# EAGLE schematic axiom_beta_interface_dummy_v0.13.8a810f79 (EAGLE 7.0.0)

## Sheet 1 of 2
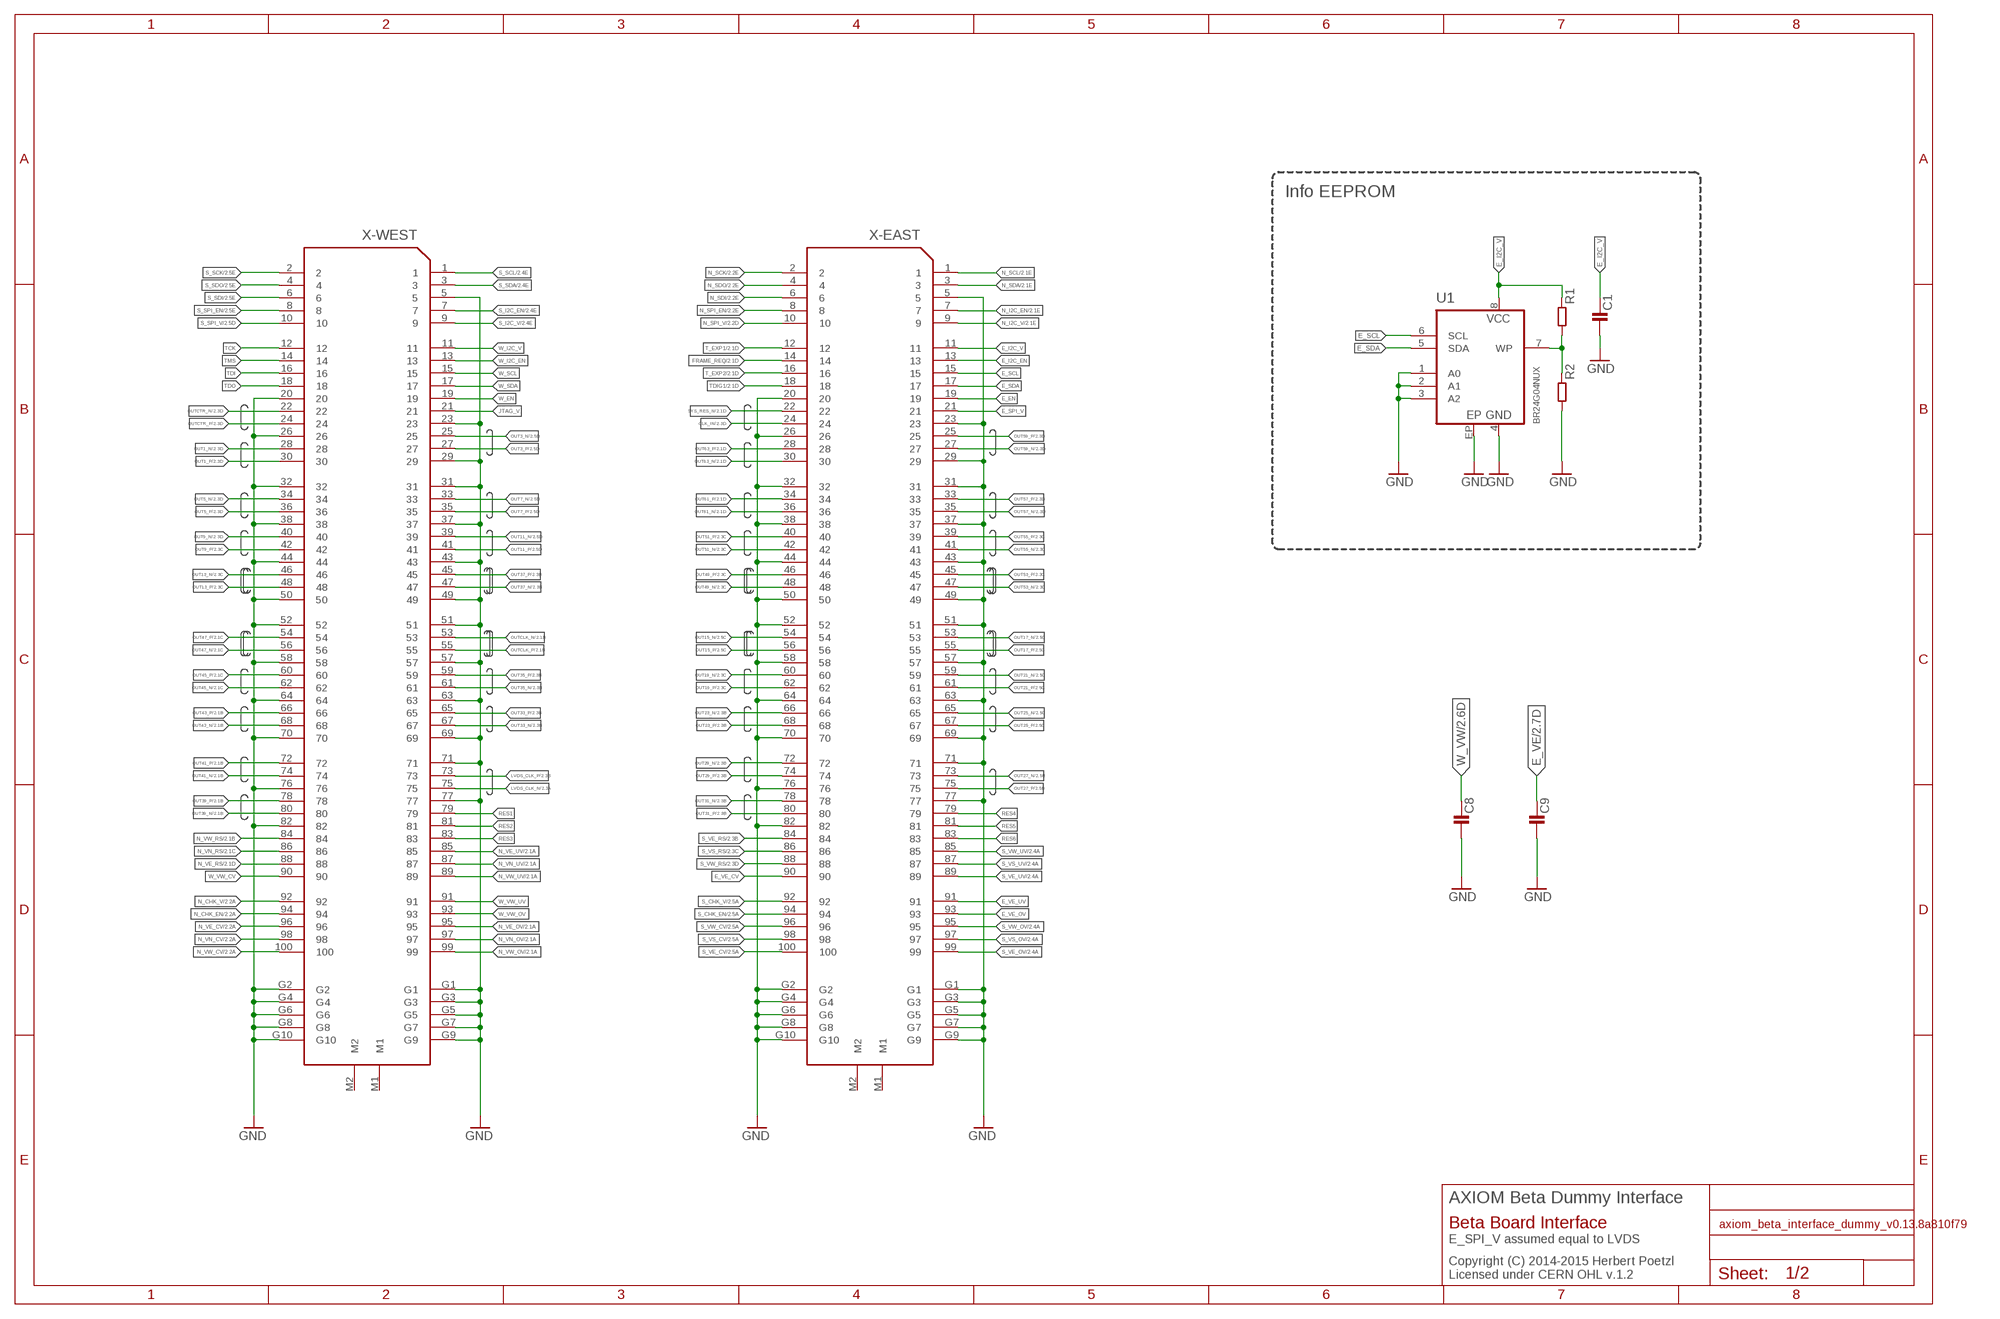
[diagram p0: schematic, sheet 1]

### Parts
C1  C0402-B  [0402-B]
C8  C0805-B  [0805-B]
C9  C0805-B  [0805-B]
R1  R0402-B  [0402-B]
R2  R0402-B  [0402-B]
U1  BR24G04NUX  [DFN200X300X100-9N]
X-EAST  FX10-100/10P  [FX10A-100P/10]
X-WEST  FX10-100/10P  [FX10A-100P/10]

### Nets
CLK_IN: X-EAST.24 ; also sheet 2
E_EN: X-EAST.19
E_I2C_EN: X-EAST.13
E_I2C_V: C1.1 R1.1 U1.8(VCC) X-EAST.11
E_SCL: U1.6(SCL) X-EAST.15
E_SDA: U1.5(SDA) X-EAST.17
E_SPI_V: X-EAST.21
E_VE: C9.1 ; also sheet 2
E_VE_CV: X-EAST.90
E_VE_OV: X-EAST.93
E_VE_UV: X-EAST.91
FRAME_REQ: X-EAST.14 ; also sheet 2
GND [power]: C1.2 C8.2 C9.2 R2.2 U1.1(A0) U1.2(A1) U1.3(A2) U1.4(GND) U1.EP X-EAST.5 X-EAST.20 X-EAST.23 X-EAST.26 X-EAST.29 X-EAST.31 X-EAST.32 X-EAST.37 X-EAST.38 X-EAST.43 X-EAST.44 X-EAST.49 X-EAST.50 X-EAST.51 X-EAST.52 X-EAST.57 X-EAST.58 X-EAST.63 X-EAST.64 X-EAST.69 X-EAST.70 X-EAST.71 X-EAST.76 X-EAST.77 X-EAST.82 X-EAST.G1 X-EAST.G2 X-EAST.G3 X-EAST.G4 X-EAST.G5 X-EAST.G6 X-EAST.G7 X-EAST.G8 X-EAST.G9 X-EAST.G10 X-WEST.5 X-WEST.20 X-WEST.23 X-WEST.26 X-WEST.29 X-WEST.31 X-WEST.32 X-WEST.37 X-WEST.38 X-WEST.43 X-WEST.44 X-WEST.49 X-WEST.50 X-WEST.51 X-WEST.52 X-WEST.57 X-WEST.58 X-WEST.63 X-WEST.64 X-WEST.69 X-WEST.70 X-WEST.71 X-WEST.76 X-WEST.77 X-WEST.82 X-WEST.G1 X-WEST.G2 X-WEST.G3 X-WEST.G4 X-WEST.G5 X-WEST.G6 X-WEST.G7 X-WEST.G8 X-WEST.G9 X-WEST.G10 ; also sheet 2
JTAG_V: X-WEST.21
LVDS_CLK_N: X-WEST.75 ; also sheet 2
LVDS_CLK_P: X-WEST.73 ; also sheet 2
N$12: R1.2 R2.1 U1.7(WP)
N_CHK_EN: X-WEST.94 ; also sheet 2
N_CHK_V: X-WEST.92 ; also sheet 2
N_I2C_EN: X-EAST.7 ; also sheet 2
N_I2C_V: X-EAST.9 ; also sheet 2
N_SCK: X-EAST.2 ; also sheet 2
N_SCL: X-EAST.1 ; also sheet 2
N_SDA: X-EAST.3 ; also sheet 2
N_SDI: X-EAST.6 ; also sheet 2
N_SDO: X-EAST.4 ; also sheet 2
N_SPI_EN: X-EAST.8 ; also sheet 2
N_SPI_V: X-EAST.10 ; also sheet 2
N_VE_CV: X-WEST.96 ; also sheet 2
N_VE_OV: X-WEST.95 ; also sheet 2
N_VE_RS: X-WEST.88 ; also sheet 2
N_VE_UV: X-WEST.85 ; also sheet 2
N_VN_CV: X-WEST.98 ; also sheet 2
N_VN_OV: X-WEST.97 ; also sheet 2
N_VN_RS: X-WEST.86 ; also sheet 2
N_VN_UV: X-WEST.87 ; also sheet 2
N_VW_CV: X-WEST.100 ; also sheet 2
N_VW_OV: X-WEST.99 ; also sheet 2
N_VW_RS: X-WEST.84 ; also sheet 2
N_VW_UV: X-WEST.89 ; also sheet 2
OUT1_N: X-WEST.28 ; also sheet 2
OUT1_P: X-WEST.30 ; also sheet 2
OUT3_N: X-WEST.25 ; also sheet 2
OUT3_P: X-WEST.27 ; also sheet 2
OUT5_N: X-WEST.34 ; also sheet 2
OUT5_P: X-WEST.36 ; also sheet 2
OUT7_N: X-WEST.33 ; also sheet 2
OUT7_P: X-WEST.35 ; also sheet 2
OUT9_N: X-WEST.40 ; also sheet 2
OUT9_P: X-WEST.42 ; also sheet 2
OUT11_N: X-WEST.39 ; also sheet 2
OUT11_P: X-WEST.41 ; also sheet 2
OUT13_N: X-WEST.46 ; also sheet 2
OUT13_P: X-WEST.48 ; also sheet 2
OUT15_N: X-EAST.54 ; also sheet 2
OUT15_P: X-EAST.56 ; also sheet 2
OUT17_N: X-EAST.53 ; also sheet 2
OUT17_P: X-EAST.55 ; also sheet 2
OUT19_N: X-EAST.60 ; also sheet 2
OUT19_P: X-EAST.62 ; also sheet 2
OUT21_N: X-EAST.59 ; also sheet 2
OUT21_P: X-EAST.61 ; also sheet 2
OUT23_N: X-EAST.66 ; also sheet 2
OUT23_P: X-EAST.68 ; also sheet 2
OUT25_N: X-EAST.65 ; also sheet 2
OUT25_P: X-EAST.67 ; also sheet 2
OUT27_N: X-EAST.73 ; also sheet 2
OUT27_P: X-EAST.75 ; also sheet 2
OUT29_N: X-EAST.72 ; also sheet 2
OUT29_P: X-EAST.74 ; also sheet 2
OUT31_N: X-EAST.78 ; also sheet 2
OUT31_P: X-EAST.80 ; also sheet 2
OUT33_N: X-WEST.67 ; also sheet 2
OUT33_P: X-WEST.65 ; also sheet 2
OUT35_N: X-WEST.61 ; also sheet 2
OUT35_P: X-WEST.59 ; also sheet 2
OUT37_N: X-WEST.47 ; also sheet 2
OUT37_P: X-WEST.45 ; also sheet 2
OUT39_N: X-WEST.80 ; also sheet 2
OUT39_P: X-WEST.78 ; also sheet 2
OUT41_N: X-WEST.74 ; also sheet 2
OUT41_P: X-WEST.72 ; also sheet 2
OUT43_N: X-WEST.68 ; also sheet 2
OUT43_P: X-WEST.66 ; also sheet 2
OUT45_N: X-WEST.62 ; also sheet 2
OUT45_P: X-WEST.60 ; also sheet 2
OUT47_N: X-WEST.56 ; also sheet 2
OUT47_P: X-WEST.54 ; also sheet 2
OUT49_N: X-EAST.48 ; also sheet 2
OUT49_P: X-EAST.46 ; also sheet 2
OUT51_N: X-EAST.42 ; also sheet 2
OUT51_P: X-EAST.40 ; also sheet 2
OUT53_N: X-EAST.47 ; also sheet 2
OUT53_P: X-EAST.45 ; also sheet 2
OUT55_N: X-EAST.41 ; also sheet 2
OUT55_P: X-EAST.39 ; also sheet 2
OUT57_N: X-EAST.35 ; also sheet 2
OUT57_P: X-EAST.33 ; also sheet 2
OUT59_N: X-EAST.27 ; also sheet 2
OUT59_P: X-EAST.25 ; also sheet 2
OUT61_N: X-EAST.36 ; also sheet 2
OUT61_P: X-EAST.34 ; also sheet 2
OUT63_N: X-EAST.30 ; also sheet 2
OUT63_P: X-EAST.28 ; also sheet 2
OUTCLK_N: X-WEST.53 ; also sheet 2
OUTCLK_P: X-WEST.55 ; also sheet 2
OUTCTR_N: X-WEST.22 ; also sheet 2
OUTCTR_P: X-WEST.24 ; also sheet 2
RES1: X-WEST.79
RES2: X-WEST.81
RES3: X-WEST.83
RES4: X-EAST.79
RES5: X-EAST.81
RES6: X-EAST.83
S_CHK_EN: X-EAST.94 ; also sheet 2
S_CHK_V: X-EAST.92 ; also sheet 2
S_I2C_EN: X-WEST.7 ; also sheet 2
S_I2C_V: X-WEST.9 ; also sheet 2
S_SCK: X-WEST.2 ; also sheet 2
S_SCL: X-WEST.1 ; also sheet 2
S_SDA: X-WEST.3 ; also sheet 2
S_SDI: X-WEST.6 ; also sheet 2
S_SDO: X-WEST.4 ; also sheet 2
S_SPI_EN: X-WEST.8 ; also sheet 2
S_SPI_V: X-WEST.10 ; also sheet 2
S_VE_CV: X-EAST.100 ; also sheet 2
S_VE_OV: X-EAST.99 ; also sheet 2
S_VE_RS: X-EAST.84 ; also sheet 2
S_VE_UV: X-EAST.89 ; also sheet 2
S_VS_CV: X-EAST.98 ; also sheet 2
S_VS_OV: X-EAST.97 ; also sheet 2
S_VS_RS: X-EAST.86 ; also sheet 2
S_VS_UV: X-EAST.87 ; also sheet 2
S_VW_CV: X-EAST.96 ; also sheet 2
S_VW_OV: X-EAST.95 ; also sheet 2
S_VW_RS: X-EAST.88 ; also sheet 2
S_VW_UV: X-EAST.85 ; also sheet 2
SYS_RES_N: X-EAST.22 ; also sheet 2
T_EXP1: X-EAST.12 ; also sheet 2
T_EXP2: X-EAST.16 ; also sheet 2
TCK: X-WEST.12
TDI: X-WEST.16
TDIG1: X-EAST.18 ; also sheet 2
TDO: X-WEST.18
TMS: X-WEST.14
W_EN: X-WEST.19
W_I2C_EN: X-WEST.13
W_I2C_V: X-WEST.11
W_SCL: X-WEST.15
W_SDA: X-WEST.17
W_VW: C8.1 ; also sheet 2
W_VW_CV: X-WEST.90
W_VW_OV: X-WEST.93
W_VW_UV: X-WEST.91
Unconnected: X-EAST.M1 X-EAST.M2 X-WEST.M1 X-WEST.M2

### Notes on the sheet
- Info EEPROM
- AXIOM Beta Dummy Interface
- Beta Board Interface
- E_SPI_V assumed equal to LVDS
- Copyright (C) 2014-2015 Herbert Poetzl
  Licensed under CERN OHL v.1.2

## Sheet 2 of 2
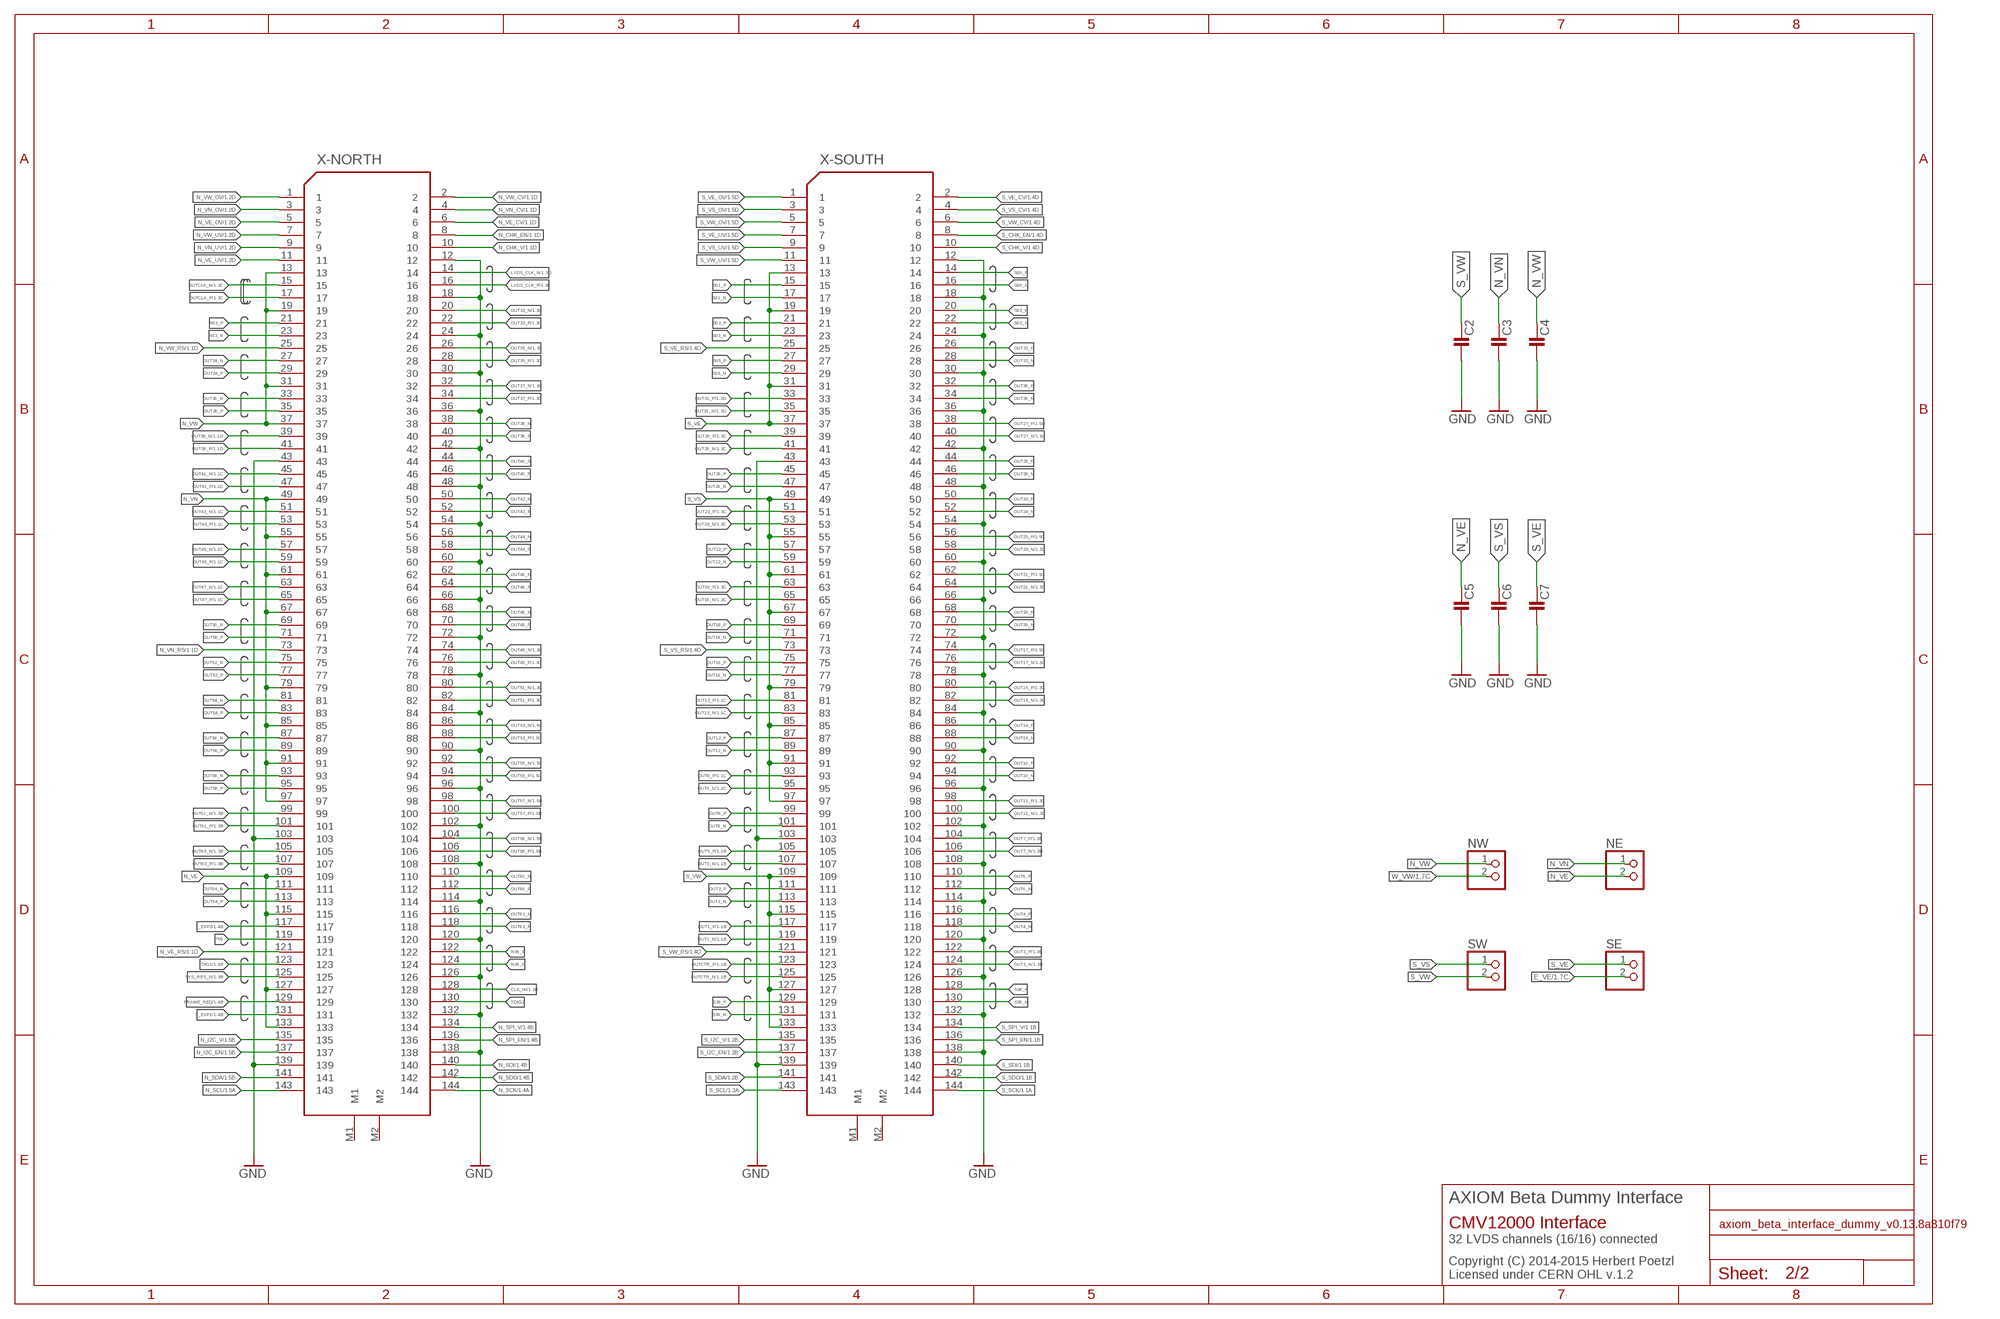
[diagram p1: schematic, sheet 2]

### Parts
C2  C0805-B  [0805-B]
C3  C0805-B  [0805-B]
C4  C0805-B  [0805-B]
C5  C0805-B  [0805-B]
C6  C0805-B  [0805-B]
C7  C0805-B  [0805-B]
NE  PINHD-1X02_2.54  [1X02]
NW  PINHD-1X02_2.54  [1X02]
SE  PINHD-1X02_2.54  [1X02]
SW  PINHD-1X02_2.54  [1X02]
X-NORTH  FX10-144S  [FX10A-144S]
X-SOUTH  FX10-144S  [FX10A-144S]

### Nets
CLK_IN: X-NORTH.128 ; also sheet 1
E_VE: SE.2 ; also sheet 1
FRAME_REQ: X-NORTH.129 ; also sheet 1
GND [power]: C2.2 C3.2 C4.2 C5.2 C6.2 C7.2 X-NORTH.12 X-NORTH.18 X-NORTH.24 X-NORTH.30 X-NORTH.36 X-NORTH.42 X-NORTH.43 X-NORTH.48 X-NORTH.54 X-NORTH.60 X-NORTH.66 X-NORTH.72 X-NORTH.78 X-NORTH.84 X-NORTH.90 X-NORTH.96 X-NORTH.102 X-NORTH.103 X-NORTH.108 X-NORTH.114 X-NORTH.120 X-NORTH.126 X-NORTH.132 X-NORTH.138 X-NORTH.139 X-SOUTH.12 X-SOUTH.18 X-SOUTH.24 X-SOUTH.30 X-SOUTH.36 X-SOUTH.42 X-SOUTH.43 X-SOUTH.48 X-SOUTH.54 X-SOUTH.60 X-SOUTH.66 X-SOUTH.72 X-SOUTH.78 X-SOUTH.84 X-SOUTH.90 X-SOUTH.96 X-SOUTH.102 X-SOUTH.103 X-SOUTH.108 X-SOUTH.114 X-SOUTH.120 X-SOUTH.126 X-SOUTH.132 X-SOUTH.138 X-SOUTH.139 ; also sheet 1
LVDS_CLK_N: X-NORTH.14 ; also sheet 1
LVDS_CLK_P: X-NORTH.16 ; also sheet 1
N03_N: X-NORTH.23
N03_P: X-NORTH.21
N36_N: X-NORTH.124
N36_P: X-NORTH.122
N_CHK_EN: X-NORTH.8 ; also sheet 1
N_CHK_V: X-NORTH.10 ; also sheet 1
N_I2C_EN: X-NORTH.137 ; also sheet 1
N_I2C_V: X-NORTH.135 ; also sheet 1
N_SCK: X-NORTH.144 ; also sheet 1
N_SCL: X-NORTH.143 ; also sheet 1
N_SDA: X-NORTH.141 ; also sheet 1
N_SDI: X-NORTH.140 ; also sheet 1
N_SDO: X-NORTH.142 ; also sheet 1
N_SPI_EN: X-NORTH.136 ; also sheet 1
N_SPI_V: X-NORTH.134 ; also sheet 1
N_VE [power]: C5.1 NE.2 X-NORTH.109 X-NORTH.115 X-NORTH.127 X-NORTH.133
N_VE_CV: X-NORTH.6 ; also sheet 1
N_VE_OV: X-NORTH.5 ; also sheet 1
N_VE_RS: X-NORTH.121 ; also sheet 1
N_VE_UV: X-NORTH.11 ; also sheet 1
N_VN [power]: C3.1 NE.1 X-NORTH.49 X-NORTH.55 X-NORTH.61 X-NORTH.67 X-NORTH.79 X-NORTH.85 X-NORTH.91 X-NORTH.97
N_VN_CV: X-NORTH.4 ; also sheet 1
N_VN_OV: X-NORTH.3 ; also sheet 1
N_VN_RS: X-NORTH.73 ; also sheet 1
N_VN_UV: X-NORTH.9 ; also sheet 1
N_VW [power]: C4.1 NW.1 X-NORTH.13 X-NORTH.19 X-NORTH.31 X-NORTH.37
N_VW_CV: X-NORTH.2 ; also sheet 1
N_VW_OV: X-NORTH.1 ; also sheet 1
N_VW_RS: X-NORTH.25 ; also sheet 1
N_VW_UV: X-NORTH.7 ; also sheet 1
OUT1_N: X-SOUTH.119 ; also sheet 1
OUT1_P: X-SOUTH.117 ; also sheet 1
OUT2_N: X-SOUTH.113
OUT2_P: X-SOUTH.111
OUT3_N: X-SOUTH.124 ; also sheet 1
OUT3_P: X-SOUTH.122 ; also sheet 1
OUT4_N: X-SOUTH.118
OUT4_P: X-SOUTH.116
OUT5_N: X-SOUTH.107 ; also sheet 1
OUT5_P: X-SOUTH.105 ; also sheet 1
OUT6_N: X-SOUTH.112
OUT6_P: X-SOUTH.110
OUT7_N: X-SOUTH.106 ; also sheet 1
OUT7_P: X-SOUTH.104 ; also sheet 1
OUT8_N: X-SOUTH.101
OUT8_P: X-SOUTH.99
OUT9_N: X-SOUTH.95 ; also sheet 1
OUT9_P: X-SOUTH.93 ; also sheet 1
OUT10_N: X-SOUTH.94
OUT10_P: X-SOUTH.92
OUT11_N: X-SOUTH.100 ; also sheet 1
OUT11_P: X-SOUTH.98 ; also sheet 1
OUT12_N: X-SOUTH.89
OUT12_P: X-SOUTH.87
OUT13_N: X-SOUTH.83 ; also sheet 1
OUT13_P: X-SOUTH.81 ; also sheet 1
OUT14_N: X-SOUTH.88
OUT14_P: X-SOUTH.86
OUT15_N: X-SOUTH.82 ; also sheet 1
OUT15_P: X-SOUTH.80 ; also sheet 1
OUT16_N: X-SOUTH.77
OUT16_P: X-SOUTH.75
OUT17_N: X-SOUTH.76 ; also sheet 1
OUT17_P: X-SOUTH.74 ; also sheet 1
OUT18_N: X-SOUTH.71
OUT18_P: X-SOUTH.69
OUT19_N: X-SOUTH.65 ; also sheet 1
OUT19_P: X-SOUTH.63 ; also sheet 1
OUT20_N: X-SOUTH.70
OUT20_P: X-SOUTH.68
OUT21_N: X-SOUTH.64 ; also sheet 1
OUT21_P: X-SOUTH.62 ; also sheet 1
OUT22_N: X-SOUTH.59
OUT22_P: X-SOUTH.57
OUT23_N: X-SOUTH.53 ; also sheet 1
OUT23_P: X-SOUTH.51 ; also sheet 1
OUT24_N: X-SOUTH.52
OUT24_P: X-SOUTH.50
OUT25_N: X-SOUTH.58 ; also sheet 1
OUT25_P: X-SOUTH.56 ; also sheet 1
OUT26_N: X-SOUTH.47
OUT26_P: X-SOUTH.45
OUT27_N: X-SOUTH.40 ; also sheet 1
OUT27_P: X-SOUTH.38 ; also sheet 1
OUT28_N: X-SOUTH.46
OUT28_P: X-SOUTH.44
OUT29_N: X-SOUTH.41 ; also sheet 1
OUT29_P: X-SOUTH.39 ; also sheet 1
OUT30_N: X-SOUTH.34
OUT30_P: X-SOUTH.32
OUT31_N: X-SOUTH.35 ; also sheet 1
OUT31_P: X-SOUTH.33 ; also sheet 1
OUT32_N: X-SOUTH.28
OUT32_P: X-SOUTH.26
OUT33_N: X-NORTH.20 ; also sheet 1
OUT33_P: X-NORTH.22 ; also sheet 1
OUT34_N: X-NORTH.27
OUT34_P: X-NORTH.29
OUT35_N: X-NORTH.26 ; also sheet 1
OUT35_P: X-NORTH.28 ; also sheet 1
OUT36_N: X-NORTH.33
OUT36_P: X-NORTH.35
OUT37_N: X-NORTH.32 ; also sheet 1
OUT37_P: X-NORTH.34 ; also sheet 1
OUT38_N: X-NORTH.38
OUT38_P: X-NORTH.40
OUT39_N: X-NORTH.39 ; also sheet 1
OUT39_P: X-NORTH.41 ; also sheet 1
OUT40_N: X-NORTH.44
OUT40_P: X-NORTH.46
OUT41_N: X-NORTH.45 ; also sheet 1
OUT41_P: X-NORTH.47 ; also sheet 1
OUT42_N: X-NORTH.50
OUT42_P: X-NORTH.52
OUT43_N: X-NORTH.51 ; also sheet 1
OUT43_P: X-NORTH.53 ; also sheet 1
OUT44_N: X-NORTH.56
OUT44_P: X-NORTH.58
OUT45_N: X-NORTH.57 ; also sheet 1
OUT45_P: X-NORTH.59 ; also sheet 1
OUT46_N: X-NORTH.62
OUT46_P: X-NORTH.64
OUT47_N: X-NORTH.63 ; also sheet 1
OUT47_P: X-NORTH.65 ; also sheet 1
OUT48_N: X-NORTH.68
OUT48_P: X-NORTH.70
OUT49_N: X-NORTH.74 ; also sheet 1
OUT49_P: X-NORTH.76 ; also sheet 1
OUT50_N: X-NORTH.69
OUT50_P: X-NORTH.71
OUT51_N: X-NORTH.80 ; also sheet 1
OUT51_P: X-NORTH.82 ; also sheet 1
OUT52_N: X-NORTH.75
OUT52_P: X-NORTH.77
OUT53_N: X-NORTH.86 ; also sheet 1
OUT53_P: X-NORTH.88 ; also sheet 1
OUT54_N: X-NORTH.81
OUT54_P: X-NORTH.83
OUT55_N: X-NORTH.92 ; also sheet 1
OUT55_P: X-NORTH.94 ; also sheet 1
OUT56_N: X-NORTH.87
OUT56_P: X-NORTH.89
OUT57_N: X-NORTH.98 ; also sheet 1
OUT57_P: X-NORTH.100 ; also sheet 1
OUT58_N: X-NORTH.93
OUT58_P: X-NORTH.95
OUT59_N: X-NORTH.104 ; also sheet 1
OUT59_P: X-NORTH.106 ; also sheet 1
OUT60_N: X-NORTH.110
OUT60_P: X-NORTH.112
OUT61_N: X-NORTH.99 ; also sheet 1
OUT61_P: X-NORTH.101 ; also sheet 1
OUT62_N: X-NORTH.116
OUT62_P: X-NORTH.118
OUT63_N: X-NORTH.105 ; also sheet 1
OUT63_P: X-NORTH.107 ; also sheet 1
OUT64_N: X-NORTH.111
OUT64_P: X-NORTH.113
OUTCLK_N: X-NORTH.15 ; also sheet 1
OUTCLK_P: X-NORTH.17 ; also sheet 1
OUTCTR_N: X-SOUTH.125 ; also sheet 1
OUTCTR_P: X-SOUTH.123 ; also sheet 1
S00_N: X-SOUTH.16
S00_P: X-SOUTH.14
S01_N: X-SOUTH.17
S01_P: X-SOUTH.15
S02_N: X-SOUTH.22
S02_P: X-SOUTH.20
S03_N: X-SOUTH.23
S03_P: X-SOUTH.21
S05_N: X-SOUTH.29
S05_P: X-SOUTH.27
S38_N: X-SOUTH.130
S38_P: X-SOUTH.128
S39_N: X-SOUTH.131
S39_P: X-SOUTH.129
S_CHK_EN: X-SOUTH.8 ; also sheet 1
S_CHK_V: X-SOUTH.10 ; also sheet 1
S_I2C_EN: X-SOUTH.137 ; also sheet 1
S_I2C_V: X-SOUTH.135 ; also sheet 1
S_SCK: X-SOUTH.144 ; also sheet 1
S_SCL: X-SOUTH.143 ; also sheet 1
S_SDA: X-SOUTH.141 ; also sheet 1
S_SDI: X-SOUTH.140 ; also sheet 1
S_SDO: X-SOUTH.142 ; also sheet 1
S_SPI_EN: X-SOUTH.136 ; also sheet 1
S_SPI_V: X-SOUTH.134 ; also sheet 1
S_VE [power]: C7.1 SE.1 X-SOUTH.13 X-SOUTH.19 X-SOUTH.31 X-SOUTH.37
S_VE_CV: X-SOUTH.2 ; also sheet 1
S_VE_OV: X-SOUTH.1 ; also sheet 1
S_VE_RS: X-SOUTH.25 ; also sheet 1
S_VE_UV: X-SOUTH.7 ; also sheet 1
S_VS [power]: C6.1 SW.1 X-SOUTH.49 X-SOUTH.55 X-SOUTH.61 X-SOUTH.67 X-SOUTH.79 X-SOUTH.85 X-SOUTH.91 X-SOUTH.97
S_VS_CV: X-SOUTH.4 ; also sheet 1
S_VS_OV: X-SOUTH.3 ; also sheet 1
S_VS_RS: X-SOUTH.73 ; also sheet 1
S_VS_UV: X-SOUTH.9 ; also sheet 1
S_VW [power]: C2.1 SW.2 X-SOUTH.109 X-SOUTH.115 X-SOUTH.127 X-SOUTH.133
S_VW_CV: X-SOUTH.6 ; also sheet 1
S_VW_OV: X-SOUTH.5 ; also sheet 1
S_VW_RS: X-SOUTH.121 ; also sheet 1
S_VW_UV: X-SOUTH.11 ; also sheet 1
SYS_RES_N: X-NORTH.125 ; also sheet 1
T_EXP1: X-NORTH.131 ; also sheet 1
T_EXP2: X-NORTH.117 ; also sheet 1
TDIG1: X-NORTH.123 ; also sheet 1
TDIG2: X-NORTH.130
TP9: X-NORTH.119
W_VW: NW.2 ; also sheet 1
Unconnected: X-NORTH.M1 X-NORTH.M2 X-SOUTH.M1 X-SOUTH.M2

### Notes on the sheet
- AXIOM Beta Dummy Interface
- CMV12000 Interface
- 32 LVDS channels (16/16) connected
- Copyright (C) 2014-2015 Herbert Poetzl
  Licensed under CERN OHL v.1.2

## Library data of the parts
C1-C9 = generic-rcl:C
NE NW SE SW = pincon:PINHD-1X02: PIN HEADER
R1 R2 = generic-rcl:R
U1 = eeprom:BR24G04
X-EAST X-WEST = fx10:FX10-100/10
X-NORTH X-SOUTH = fx10:FX10-144

## Net classes
0 default: width 0.152 mm, drill 0.203 mm
1 power: width 0.152 mm, drill 0.203 mm